# Altium project USB_Board.PrjPcb
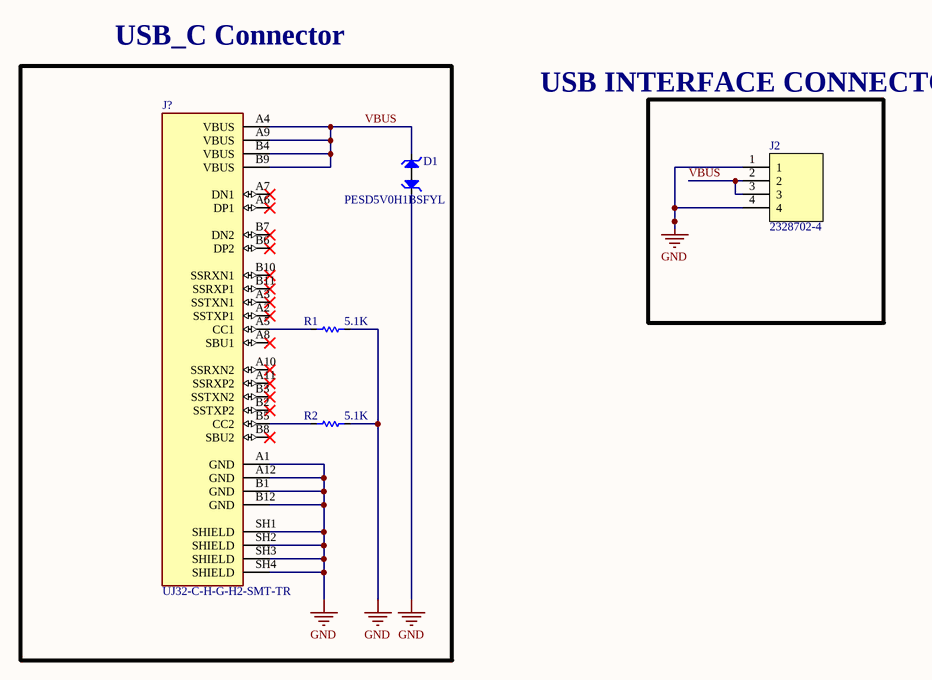
[diagram p0: USB-Sheet.SchDoc]
1 sheet, 5 parts. Net scope: global (net labels, ports and power ports of the same name join across sheets).
Board file: PCB_USB_Board.PcbDoc

## Sheet USB-Sheet.SchDoc
size A; SheetNumber: 1; SheetTotal: 1

### Parts
D1  PESD5V0H1BSFYL  [DSN0603-2]
J2  2328702-4  [TE_2328702-4]
J?  UJ32-C-H-G-H2-SMT-TR  [CUI_UJ32-C-H-G-H2-SMT-TR]
R1  5.1K  [Res-0201]
R2  5.1K  [Res-0201]

### Blocks framed on the sheet
USB_C Connector: D1 J? R1 R2

### Nets
GND: D1.1 J2.1 J2.4 J?.A1(GND) J?.A12(GND) J?.B1(GND) J?.B12(GND) J?.SH1(SHIELD) J?.SH2(SHIELD) J?.SH3(SHIELD) J?.SH4(SHIELD) R1.1 R2.1
VBUS: D1.2 J2.2 J2.3 J?.A4(VBUS) J?.A9(VBUS) J?.B4(VBUS) J?.B9(VBUS)
NetJ?_A5: J?.A5(CC1) R1.2
NetJ?_B5: J?.B5(CC2) R2.2

Not connected (* = marked no-connect by the designer): J? A2(SSTXP1)* A3(SSTXN1)* A6(DP1)* A7(DN1)* A8(SBU1)* A10(SSRXN2)* A11(SSRXP2)* B2(SSTXP2)* B3(SSTXN2)* B6(DP2)* B7(DN2)* B8(SBU2)* B10(SSRXN1)* B11(SSRXP1)*

### Notes on the sheet
- USB INTERFACE CONNECTOR

### Library data of the parts
D1 = PESD5V0H1BSFYL: 5V Clamp 7A (8/20µs) Ipp Tvs Diode Surface Mount DSN0603-2; Manufacturer: Nexperia USA Inc.; Manufacturer Part Number: PESD5V0H1BSFYL; Digikey Part Number: 1727-2675-6-ND; Item Type: TVS Diode; Package: 0603; ComponentLink1Description: Digikey Link; ComponentLink1URL: https://www.digikey.com/en/products/detail/nexperia-usa-inc/PESD5V0H1BSFYL/5981341?s=N4IgTCBcDaIAoFEDKARArANQAwAkCMAQkgGICaAMiALoC%2BQA
J2 = 2328702-4: 4 Position FPC Connector Contacts, Top and Bottom 0.020 (0.50mm) Surface Mount, Right Angle; MF: TE Connectivity AMP Connectors; Package: None; Price: None; Check_prices: https://www.snapeda.com/parts/2328702-4/TE+Connectivity/view-part/?ref=eda; Value: *; SnapEDA_Link: https://www.snapeda.com/parts/2328702-4/TE+Connectivity/view-part/?ref=snap; MP: 2328702-4; Availability: In Stock; Purchase-URL: https://pricing.snapeda.com/search?q=2328702-4&ref=eda
J? = UJ32-C-H-G-H2-SMT-TR: Type C, USB 3.2 Gen 2x2, 20 Gbps, 20 Vac, 5 A, Right Angle, Gold Flash, Surface Mount, Black Insulator, USB Receptacle; MF: CUI Devices; SnapEDA_Link: https://www.snapeda.com/parts/UJ32-C-H-G-H2-SMT-TR/CUI+Devices/view-part/?ref=snap; Package: None; Value: *; CUI_purchase_URL: https://www.cuidevices.com/product/interconnect/connectors/usb-connectors/uj32-c-h-g-h2-smt-tr?utm_source=snapeda.com&utm_medium=referral&utm_campaign=snapedaBOM; MP: UJ32-C-H-G-H2-SMT-TR; Check_prices: https://www.snapeda.com/parts/UJ32-C-H-G-H2-SMT-TR/CUI+Devices/view-part/?ref=eda
R1 R2 = RC0201FR-075K1L: RES 5.1K OHM 1% 1/20W 0201; Manufacturer: Yageo; Power Rating: 50mW; Value: 5.1kR; Voltage Rating: 25V; Temperature Coefficient: 200ppm/°C; Item Type: Resistor; Supplier: Future Electronics; Supplier Part Number: 9072847; Manufacturer Part Number: RC0201FR-075K1L; RoHS: Yes; Category: Chip SMD Resistors; Stock: 280000; Pricing: 10000=0.0014, 40000=0.0013, 200000=0.0013, 400000=0.0012, 1250000=0.0011 (USD); Case/Package: 0201; Case Code (Imperial): 0201; Case Code (Metric): 0603; Min Operating Temperature: -55°C; Max Operating Temperature: 125°C; Packaging: Tape and Reel; Tolerance: 1%; Termination: SMD/SMT; Number of Terminations: 2; Max Power Dissipation: 50mW; Features: Moisture Resistant; Series: RC; Length: 0.6mm; Width: 0.3mm; Height: 0.23mm; Lead Free: Lead Free; RoHS Compliant: Yes; ComponentLink1URL: http://www.mouser.com/ds/2/447/RC0201-559633.pdf?src-supplier=Mouser; ComponentLink1Description: http://www.mouser.com/ds/2/447/RC0201-559633.pdf?src-supplier=Mouser; ComponentLink2URL: https://datasheet.octopart.com/RC0201FR-075K1L-Yageo-datasheet-164759695.pdf?src-supplier=Future+Electronics; ComponentLink2Description: https://datasheet.octopart.com/RC0201FR-075K1L-Yageo-datasheet-164759695.pdf?src-supplier=Future+Electronics; ComponentLink3URL: http://www.yageo.com/documents/recent/PYu-RC_Group_51_RoHS_L_10.pdf?src-supplier=Digi-Key; ComponentLink3Description: http://www.yageo.com/documents/recent/PYu-RC_Group_51_RoHS_L_10.pdf?src-supplier=Digi-Key; LCSC Part Number: C274341; Digikey Part Number: YAG2741DKR-ND